# Altium schematic sheet mk.SchDoc
size 420 x 297 mm; DocumentNumber: Core of logic
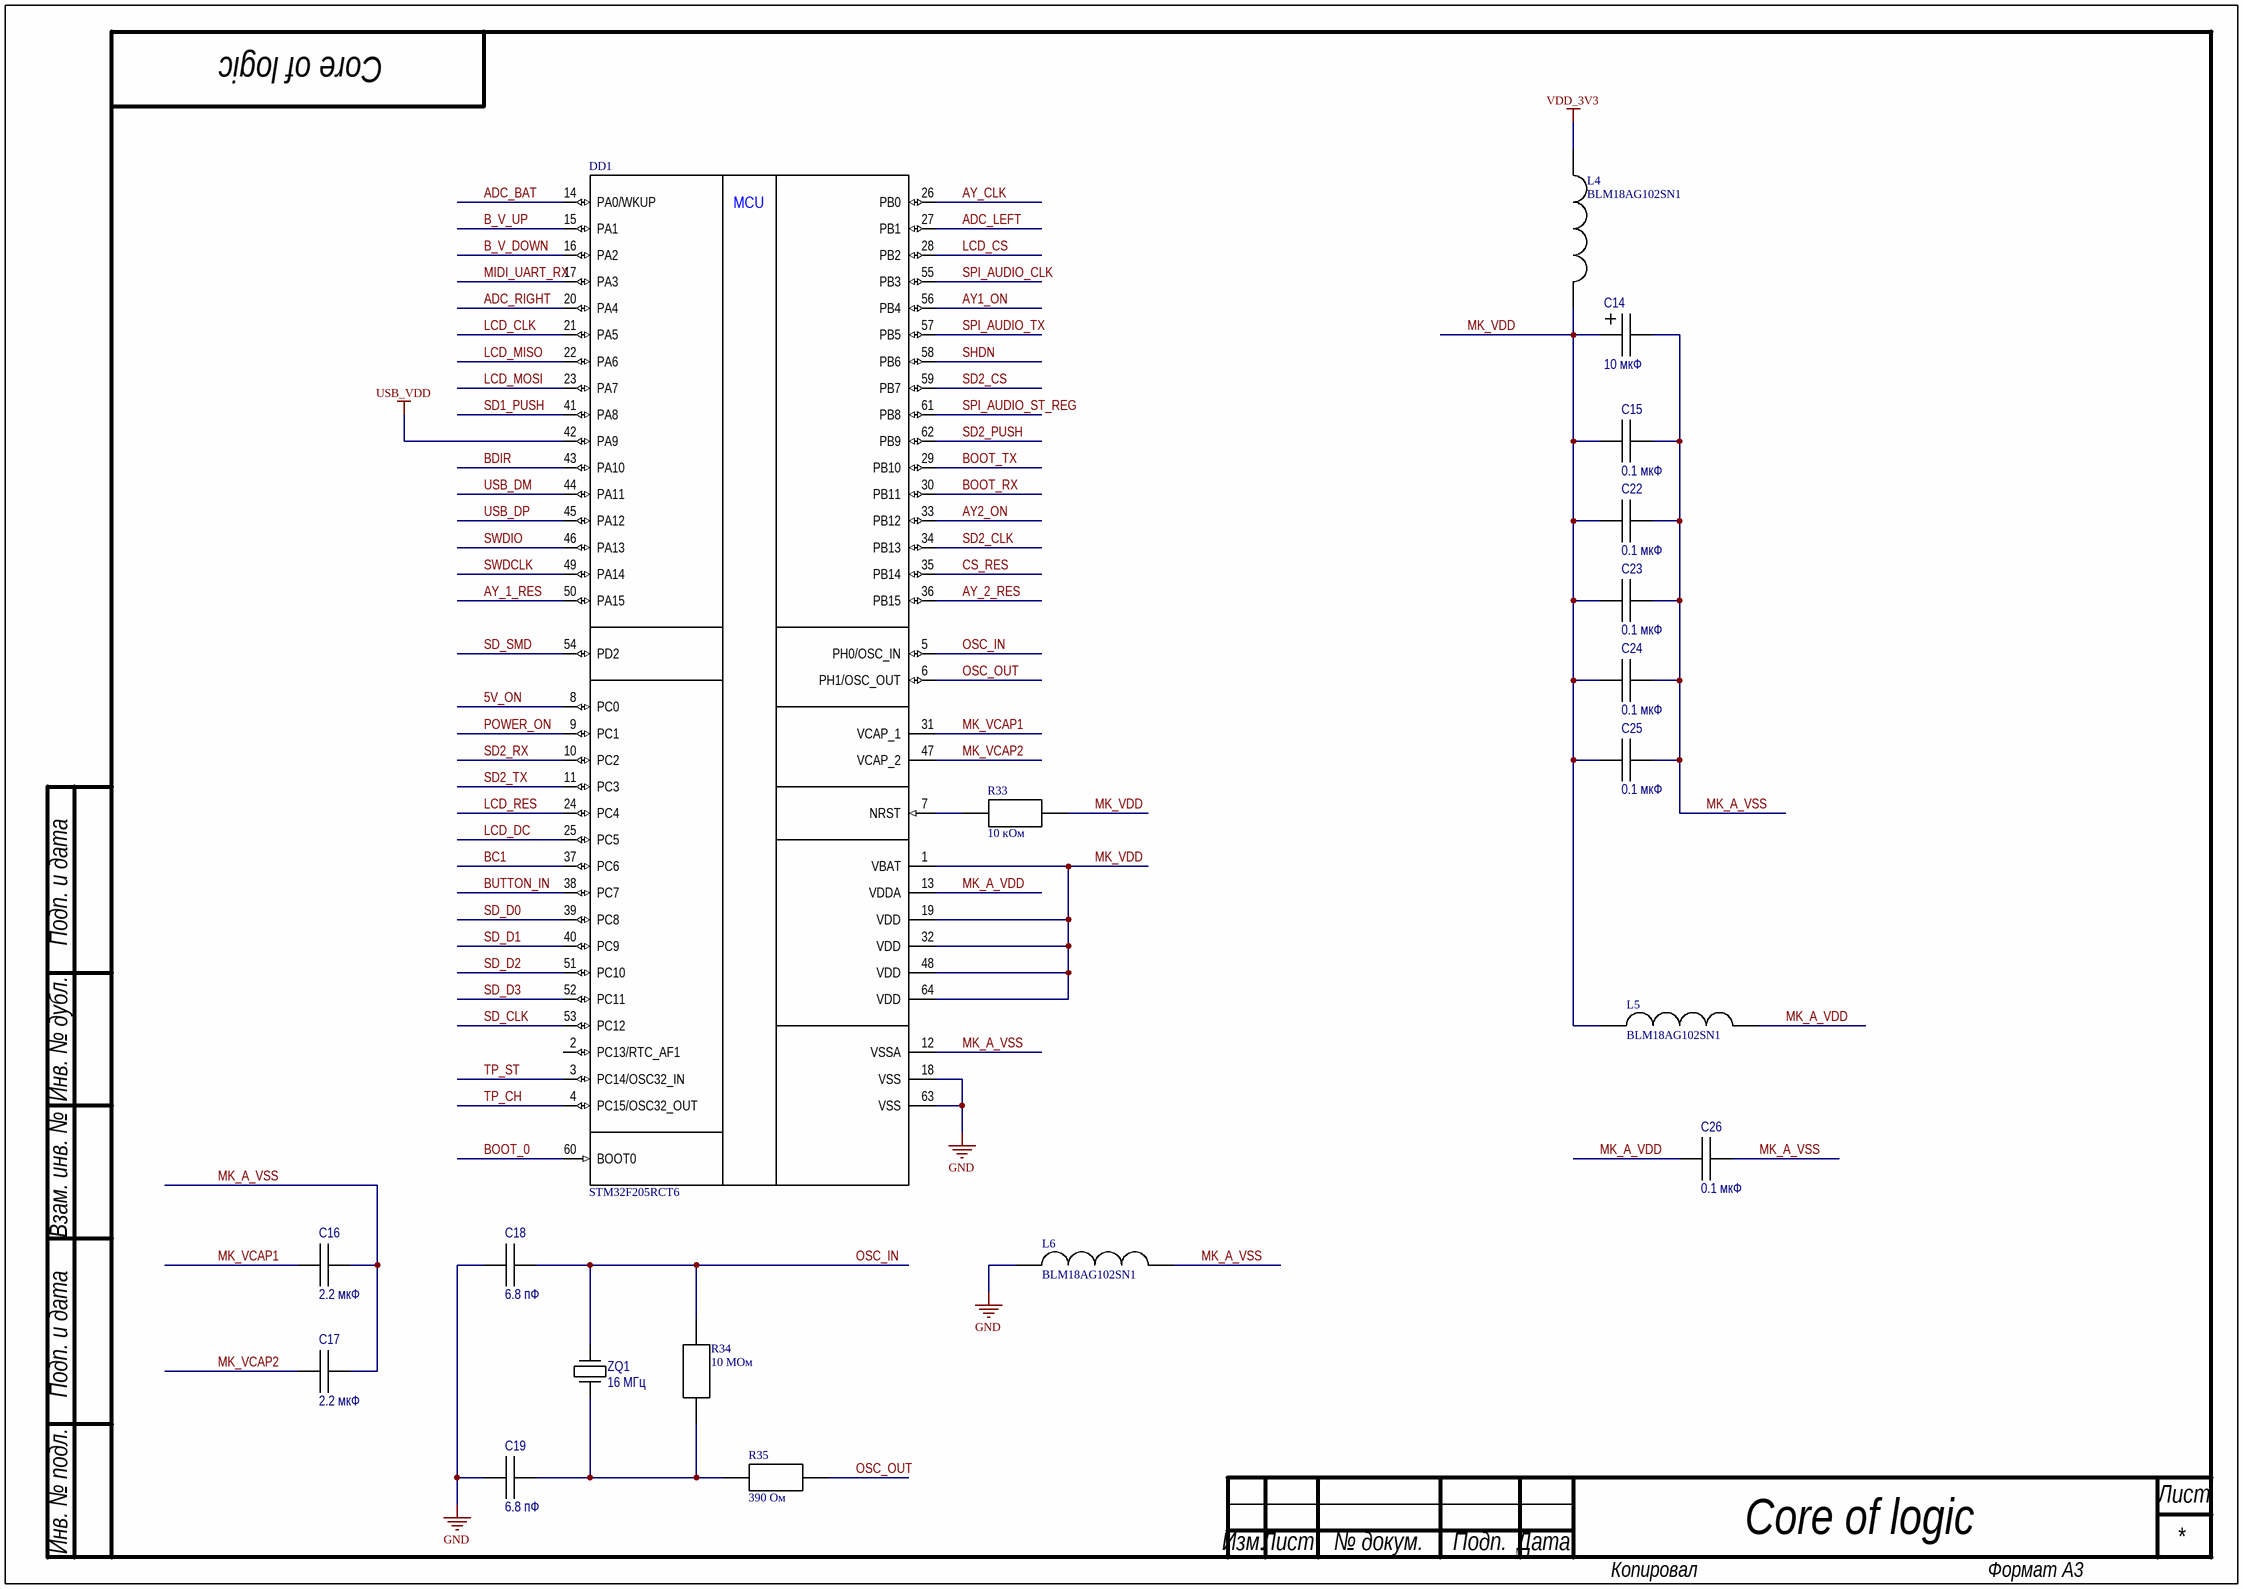
[diagram p0: mk.SchDoc]

## Parts
C14  10 мкФ  [C TAN_C]
C15  0.1 мкФ  [C 1206]
C16  2.2 мкФ  [C 1206]
C17  2.2 мкФ  [C 1206]
C18  6.8 пФ  [C 1206]
C19  6.8 пФ  [C 1206]
C22  0.1 мкФ  [C 1206]
C23  0.1 мкФ  [C 1206]
C24  0.1 мкФ  [C 1206]
C25  0.1 мкФ  [C 1206]
C26  0.1 мкФ  [C 1206]
DD1  STM32F205RCT6  [LQFP64]
L4  BLM18AG102SN1  [FB 0603]
L5  BLM18AG102SN1  [FB 0603]
L6  BLM18AG102SN1  [FB 0603]
R33  10 кОм  [RES 0805]
R34  10 МОм  [RES 0805]
R35  390 Ом  [RES 0805]
ZQ1  value 16 МГц  [NX3225SA]  (hidden comment: NX3225SA-16.000M-STD-CRS-2)

## Nets
GND: C18.1 C19.1 DD1.18(VSS) DD1.63(VSS) L6.1
USB_VDD: DD1.42(PA9)
VDD_3V3: L4.1
5V_ON: DD1.8(PC0)
ADC_BAT: DD1.14(PA0/WKUP)
ADC_LEFT: DD1.27(PB1)
ADC_RIGHT: DD1.20(PA4)
AY1_ON: DD1.56(PB4)
AY2_ON: DD1.33(PB12)
AY_1_RES: DD1.50(PA15)
AY_2_RES: DD1.36(PB15)
AY_CLK: DD1.26(PB0)
B_V_DOWN: DD1.16(PA2)
B_V_UP: DD1.15(PA1)
BC1: DD1.37(PC6)
BDIR: DD1.43(PA10)
BOOT_0: DD1.60(BOOT0)
BOOT_RX: DD1.30(PB11)
BOOT_TX: DD1.29(PB10)
BUTTON_IN: DD1.38(PC7)
CS_RES: DD1.35(PB14)
LCD_CLK: DD1.21(PA5)
LCD_CS: DD1.28(PB2)
LCD_DC: DD1.25(PC5)
LCD_MISO: DD1.22(PA6)
LCD_MOSI: DD1.23(PA7)
LCD_RES: DD1.24(PC4)
MIDI_UART_RX: DD1.17(PA3)
MK_A_VDD: C26.1 DD1.13(VDDA) L5.2
MK_A_VSS: C14.2 C15.2 C16.2 C17.2 C22.2 C23.2 C24.2 C25.2 C26.2 DD1.12(VSSA) L6.2
MK_VCAP1: C16.1 DD1.31(VCAP_1)
MK_VCAP2: C17.1 DD1.47(VCAP_2)
MK_VDD: C14.1 C15.1 C22.1 C23.1 C24.1 C25.1 DD1.1(VBAT) DD1.19(VDD) DD1.32(VDD) DD1.48(VDD) DD1.64(VDD) L4.2 L5.1 R33.2
OSC_IN: C18.2 DD1.5(PH0/OSC_IN) R34.2 ZQ1.3(XO)
OSC_OUT: DD1.6(PH1/OSC_OUT) R35.2
POWER_ON: DD1.9(PC1)
SD1_PUSH: DD1.41(PA8)
SD2_CLK: DD1.34(PB13)
SD2_CS: DD1.59(PB7)
SD2_PUSH: DD1.62(PB9)
SD2_RX: DD1.10(PC2)
SD2_TX: DD1.11(PC3)
SD_CLK: DD1.53(PC12)
SD_D0: DD1.39(PC8)
SD_D1: DD1.40(PC9)
SD_D2: DD1.51(PC10)
SD_D3: DD1.52(PC11)
SD_SMD: DD1.54(PD2)
SHDN: DD1.58(PB6)
SPI_AUDIO_CLK: DD1.55(PB3)
SPI_AUDIO_ST_REG: DD1.61(PB8)
SPI_AUDIO_TX: DD1.57(PB5)
SWDCLK: DD1.49(PA14)
SWDIO: DD1.46(PA13)
TP_CH: DD1.4(PC15/OSC32_OUT)
TP_ST: DD1.3(PC14/OSC32_IN)
USB_DM: DD1.44(PA11)
USB_DP: DD1.45(PA12)
NetC19_2: C19.2 R34.1 R35.1 ZQ1.1(XI)
NetDD1_7: DD1.7(NRST) R33.1

Not connected (* = marked no-connect by the designer): DD1 2(PC13/RTC_AF1); ZQ1 2(NC) 4(NC)

## Notes on the sheet
- Подп. и дата
- Инв. № дубл.
- Взам. инв. №
- Инв. № подл.
- Лист
- Изм.
- № докум.
- Подп.
- Дата
- Копировал
- Формат А3
- (in symbol STM32F205RCT6) MCU

## Library data of the parts
C14 = CAP TAN_C: SMD Tantalium Capacitor C; Manufacturer: /Укажите компанию-производителя/; Tolerance: /Укажите допуск в процентах/; Type: Конденсатор танталовый; ESR: /Укажите значение ЭПС/; Size: C; Temperature range: /Формат: -? ... ? °C/; Value: 10 мкФ
C15-C19 C22-C26 = CAP 1206: SMD Capacitor 1206; Manufacturer: /Укажите компанию-производителя/; Tolerance: /Укажите допуск в процентах/; Temperature coefficient: /Формат: ±? ppm/°C/; Type: Конденсатор керамический; TC: /Укажите тип диэлектрика/; Size: 1206; Temperature range: /Формат: -? ... ? °C/
  C15 C22-C26: Value: 0.1 мкФ
  C16 C17: Value: 2.2 мкФ
  C18 C19: Value: 6.8 пФ
R33-R35 = RES 0805
ZQ1 = NX3225SA-16.000M-STD-CRS-2: QUARTZ CRYSTAL; Manufacturer: NDK; Load capacitance: 8 пФ; Frequency stability: ±15 ppm; Type: Кварцевый резонатор; Temperature range: -40 ... 125 °C